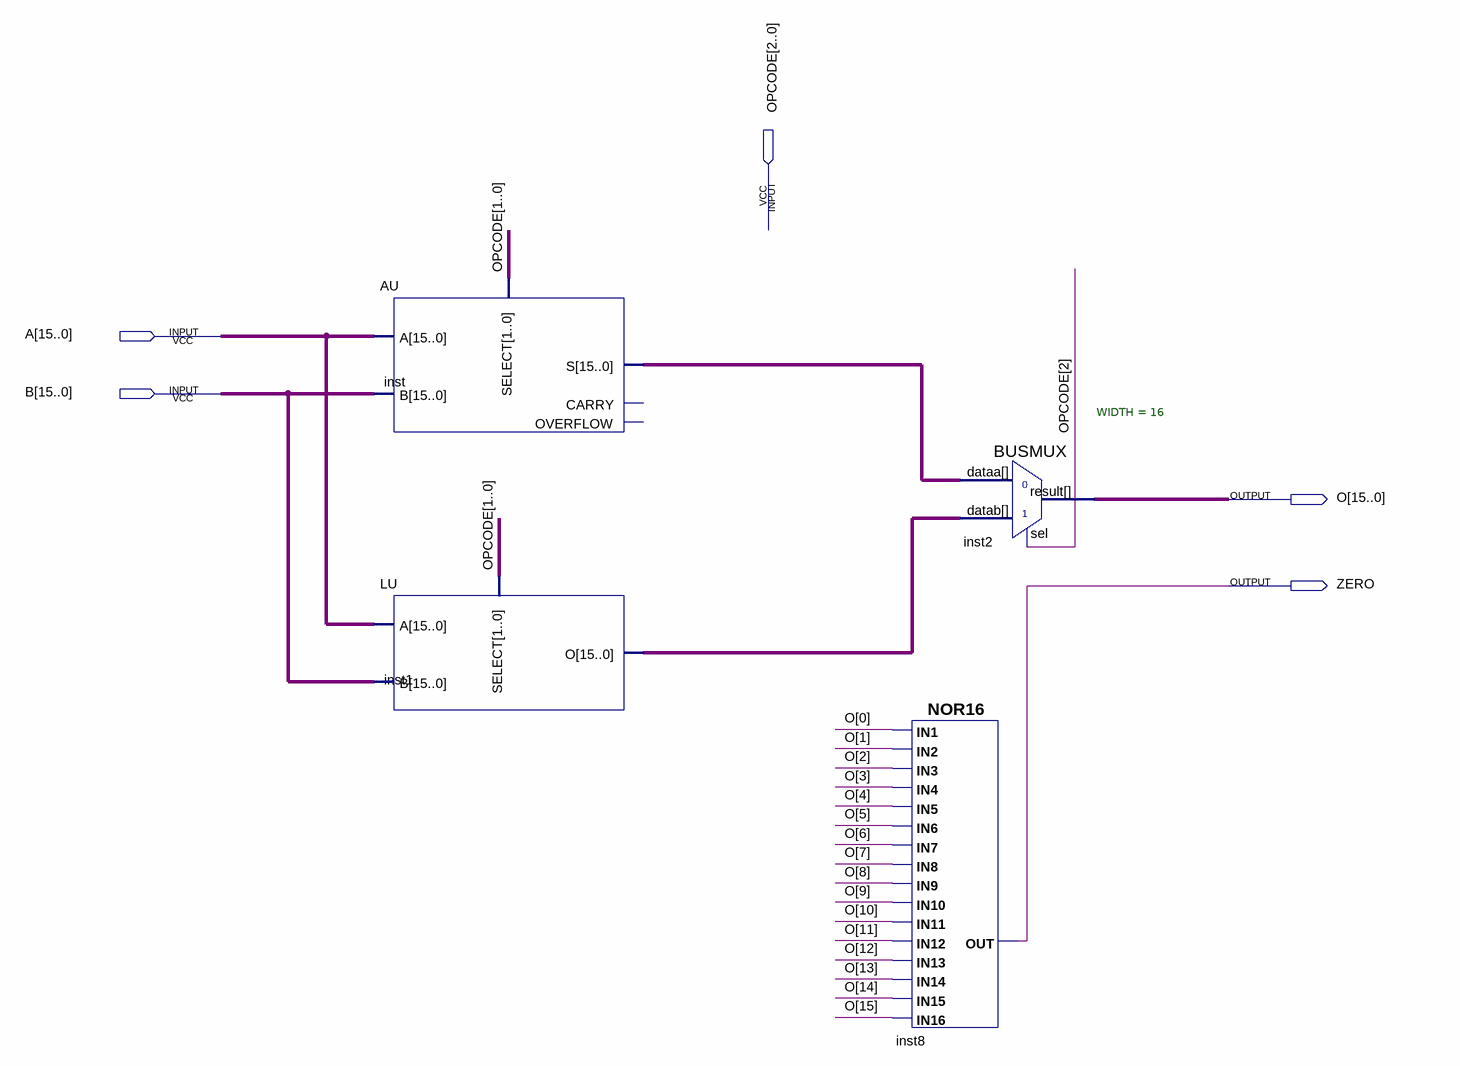
[diagram p0: schematic sheet]
// Quartus schematic ALU.bdf as structural Verilog: 4 symbols, 5 pins
module ALU (
  input  [2:0] OPCODE,
  input  [15:0] A,
  input  [15:0] B,
  output [15:0] O,
  output ZERO
);

  wire [15:0] inst1_o, inst_s;

  AU inst (.A(A), .B(B), .SELECT(OPCODE[1:0]), .S(inst_s));  // open: CARRY, OVERFLOW
  LU inst1 (.A(A), .B(B), .SELECT(OPCODE[1:0]), .O(inst1_o));
  nor inst8 (ZERO, O[0], O[1], O[2], O[3], O[4], O[5], O[6], O[7], O[8], O[9], O[10], O[11], O[12], O[13], O[14], O[15]);
  BUSMUX #(.WIDTH(16)) inst2 (.datab(inst1_o), .sel(OPCODE[2]), .dataa(inst_s), .result(O));
endmodule
